# Altium schematic sheet Beacon Sensor.SchDoc
size A4; Organization: Altium Limited; Address1: L3, 12a Rodborough Rd; Address2: Frenchs Forest; Address3: NSW; Address4: Australia 2086
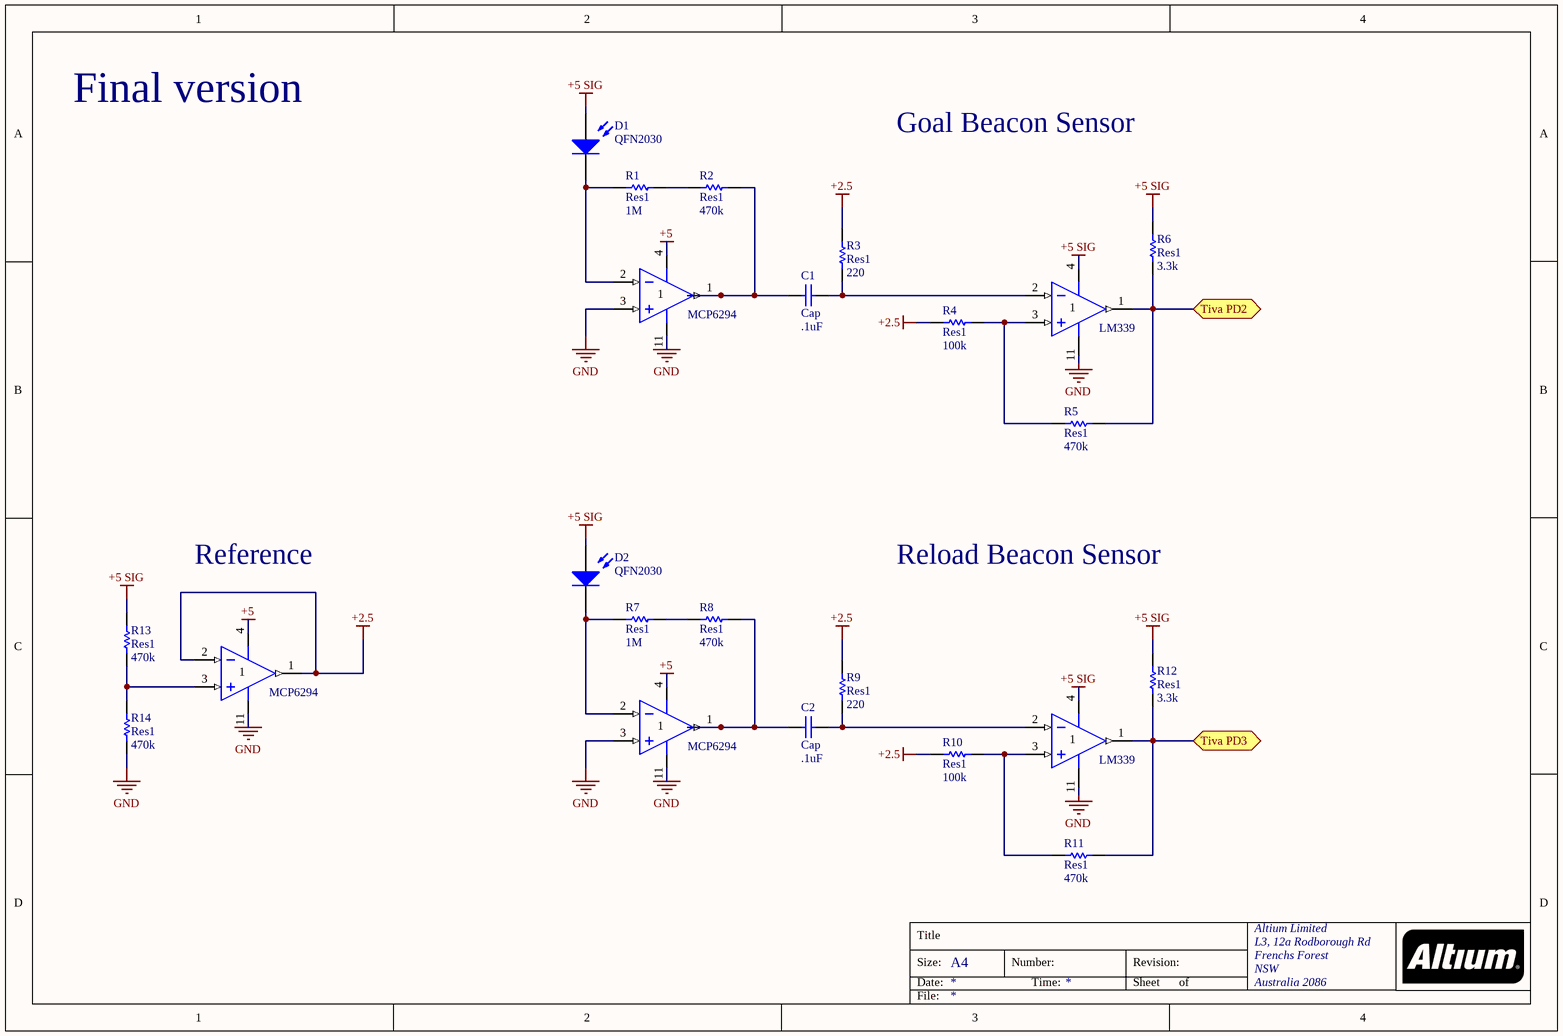
[diagram p0: Beacon Sensor.SchDoc]

## Parts
C1  Cap  value .1uF  [RAD-0.3]
C2  Cap  value .1uF  [RAD-0.3]
D1  QFN2030  [PIN2]
D2  QFN2030  [PIN2]
R1  Res1  value 1M  [AXIAL-0.3]
R2  Res1  value 470k  [AXIAL-0.3]
R3  Res1  value 220  [AXIAL-0.3]
R4  Res1  value 100k  [AXIAL-0.3]
R5  Res1  value 470k  [AXIAL-0.3]
R6  Res1  value 3.3k  [AXIAL-0.3]
R7  Res1  value 1M  [AXIAL-0.3]
R8  Res1  value 470k  [AXIAL-0.3]
R9  Res1  value 220  [AXIAL-0.3]
R10  Res1  value 100k  [AXIAL-0.3]
R11  Res1  value 470k  [AXIAL-0.3]
R12  Res1  value 3.3k  [AXIAL-0.3]
R13  Res1  value 470k  [AXIAL-0.3]
R14  Res1  value 470k  [AXIAL-0.3]
U1  MCP6294  [DIP-14]  (part A of 4)
U2  LM339  [DIP-14]  (part A of 4)
U3  MCP6294  [DIP-14]  (part A of 4)
U4  LM339  [DIP-14]  (part A of 4)
U5  MCP6294  [DIP-14]  (part A of 4)

## Ports
Tiva PD2, Tiva PD3

## Nets
+2.5: R3.2 R4.2 R9.2 R10.2 U5.1(OUT) U5.2(IN-)
+5: U1.4(V+) U3.4(V+) U5.4(V+)
+5 SIG: D1.1(A) D2.1(A) R6.1 R12.1 R13.1 U2.4(V+) U4.4(V+)
GND: R14.2 U1.3(IN+) U1.11(GND) U2.11(GND) U3.3(IN+) U3.11(GND) U4.11(GND) U5.11(GND)
Tiva PD2: R5.1 R6.2 U2.1(OUT) ; port Tiva PD2
Tiva PD3: R11.1 R12.2 U4.1(OUT) ; port Tiva PD3
NetC1_1: C1.1 R2.2 U1.1(OUT)
NetC1_2: C1.2 R3.1 U2.2(IN-)
NetC2_1: C2.1 R8.2 U3.1(OUT)
NetC2_2: C2.2 R9.1 U4.2(IN-)
NetD1_2: D1.2(K) R1.1 U1.2(IN-)
NetD2_2: D2.2(K) R7.1 U3.2(IN-)
NetR1_2: R1.2 R2.1
NetR4_1: R4.1 R5.2 U2.3(IN+)
NetR7_2: R7.2 R8.1
NetR10_1: R10.1 R11.2 U4.3(IN+)
NetR13_2: R13.2 R14.1 U5.3(IN+)

## Notes on the sheet
- Final version
- Goal Beacon Sensor
- Reference
- Reload Beacon Sensor
- Title
- Size:
- Date:
- A4
- Number:
- Time:
- Revision:
- Sheet
- of
- File:

## Library data of the parts
C1 C2 = Cap: Capacitor; Manufacturer: Generic Components; Class: Passive; Published: 08/06/2000; Publisher: Altium Hobart Technology Centre; SubClass: Capacitor
D1 D2 = Photo Sen: Photosensitive Diode; Manufacturer: Generic Components; Class: Optoelectronic; Published: 1999
R1-R14 = Res1: Resistor; Manufacturer: Generic Components; Class: Passive; Published: 08/06/2000; Publisher: Altium Hobart Technology Centre; SubClass: Resistor
U1-U5 = LM324AJ: Low-Power Quad Operational Amplifier; Manufacturer: National Semiconductor; Published: 15/04/2002; Publisher: Altium Hobart Technology Centre; Class: Amplifier; SubClass: Operational Amplifier